# EAGLE design Power Switching Circuit rev2 (EAGLE 9.6.2)
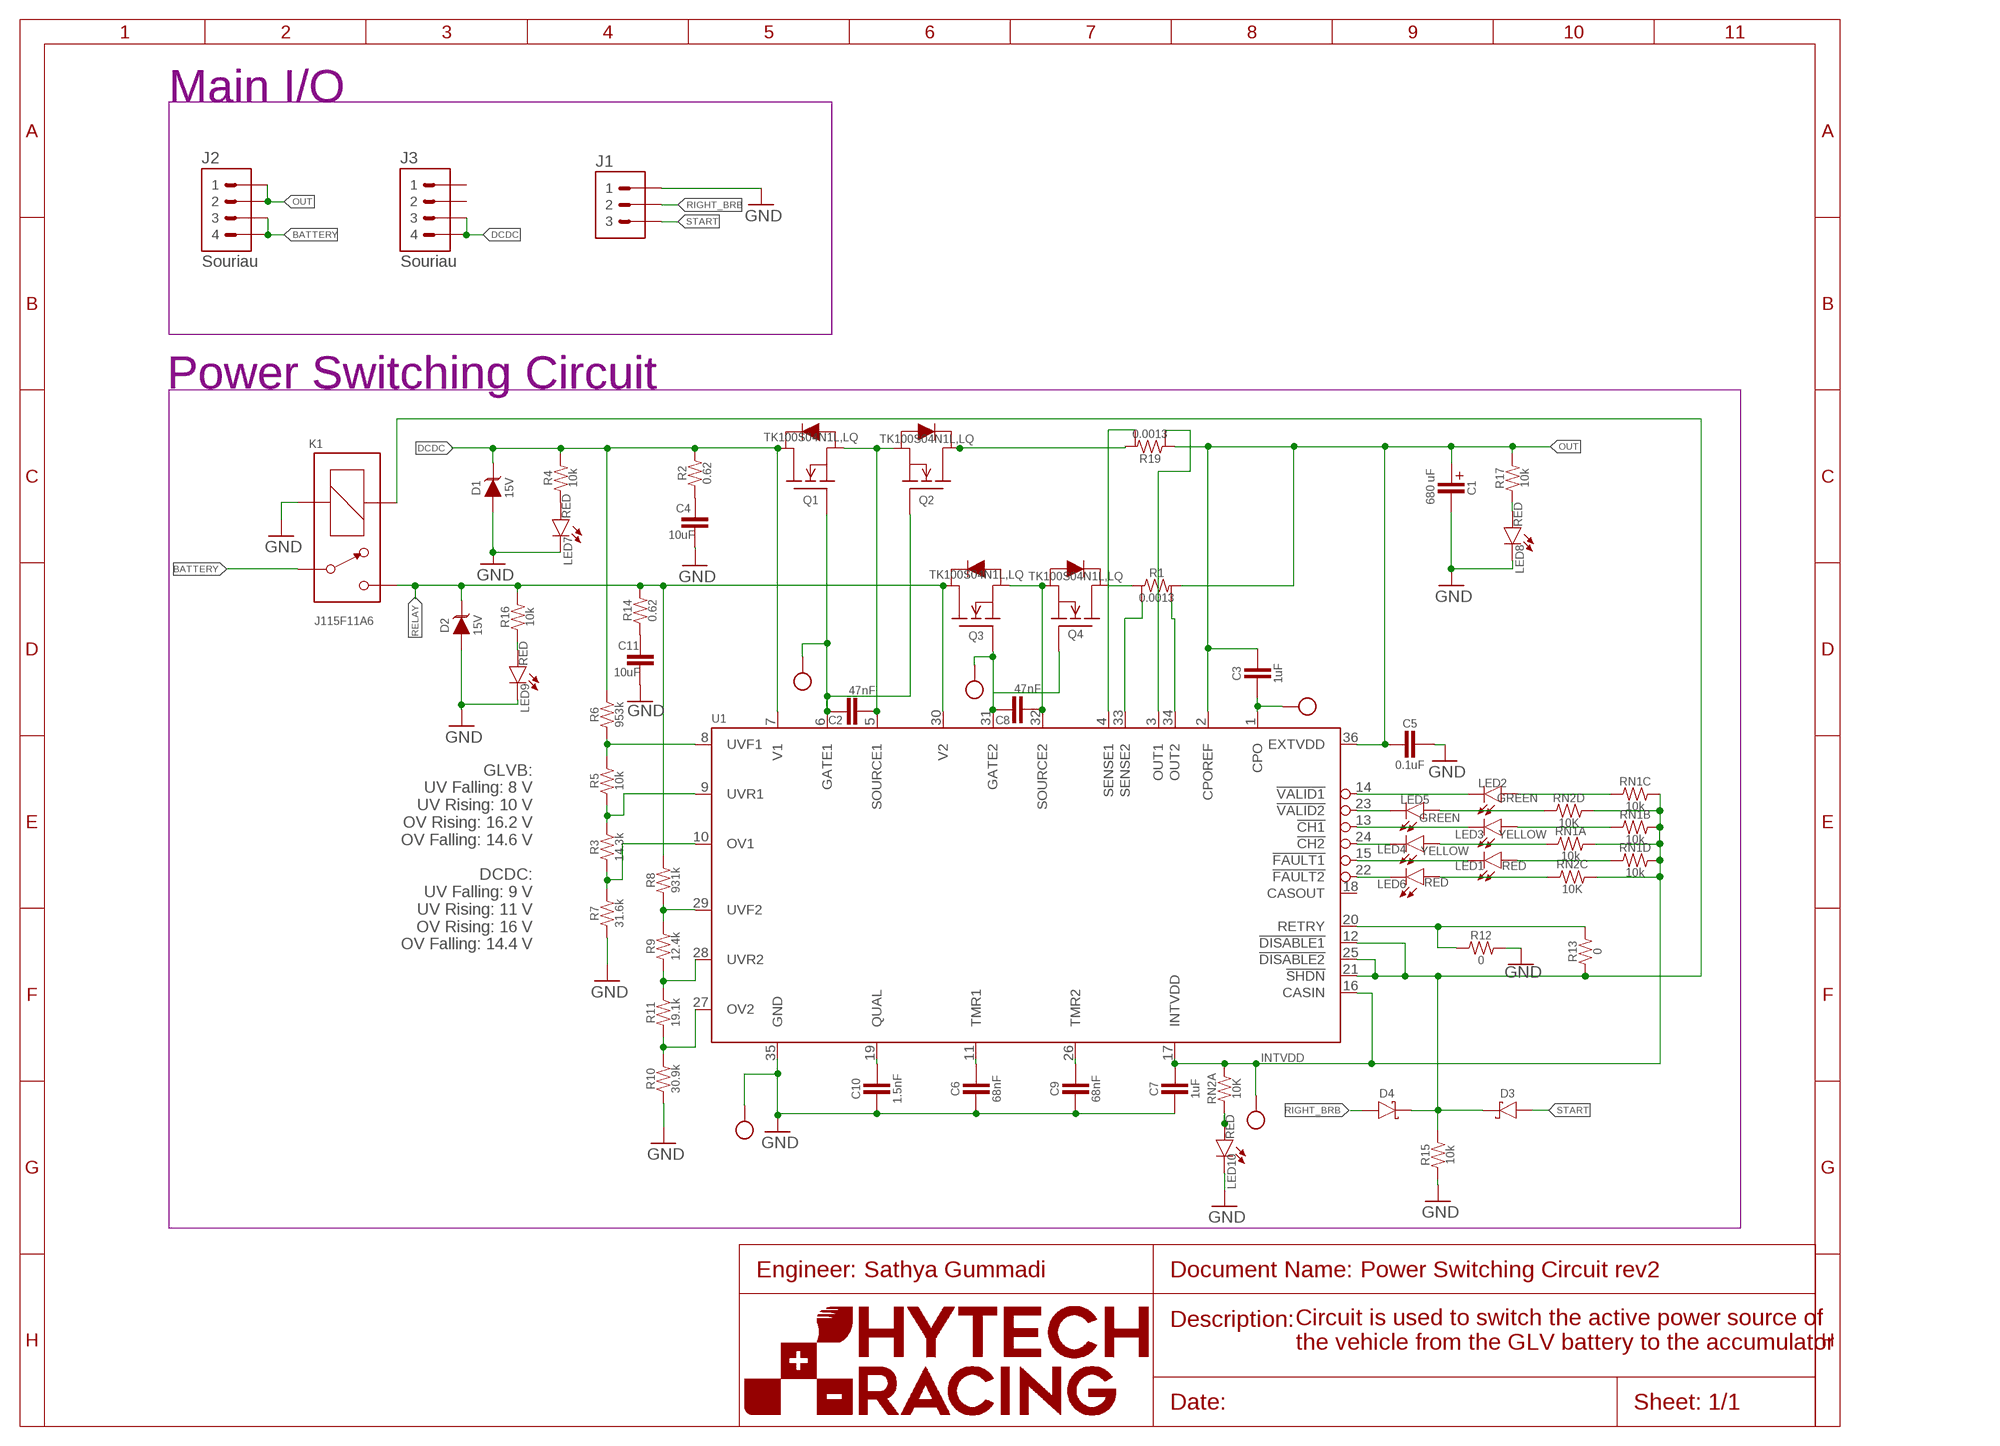
[diagram p0: schematic, sheet 1]
U$2 (FRAME_A): FRAME_DESCRIPTION: Default; ORIENTATION: LANDSCAPE; SIZE: A

## Parts
C1  CAPACITOR_POLARIZED  [EEE-FK1H681AM]
C2  47nF  CAP0603-CAP  [0603-CAP@1]
C3  1uF  CAP0805  [0805]
C4  10uF  CAPACITOR_VALUE1206  [1206-CAP]
C5  0.1uF  CAP0603-CAP  [0603-CAP@1]
C6  68nF  CAP0603-CAP  [0603-CAP@1]
C7  1uF  CAP0805  [0805]
C8  47nF  CAP0603-CAP  [0603-CAP@1]
C9  68nF  CAP0603-CAP  [0603-CAP@1]
C10  1.5nF  CAP0603-CAP  [0603-CAP@1]
C11  10uF  CAPACITOR_VALUE1206  [1206-CAP]
D1  TVS_15V  [SOT-23]
D2  TVS_15V  [SOT-23]
D3  SCHOTTKY  [CLP1608-2L]
D4  SCHOTTKY  [CLP1608-2L]
J1  CONNECTOR-3_  [SOURIAU_04-35]
J2  CONNECTOR-4_SOURIAU_  [SOURIAU_12-04]
J3  CONNECTOR-4_SOURIAU_  [SOURIAU_12-04]
K1  J115F11A6  [J115F11A*6*]
LED1  RED  LED-0603  [LED-603]
LED2  GREEN  LED-0603  [LED-603]
LED3  YELLOW  LED-0603  [LED-603]
LED4  YELLOW  LED-0603  [LED-603]
LED5  GREEN  LED-0603  [LED-603]
LED6  RED  LED-0603  [LED-603]
LED7  RED  LED-0603  [LED-603]
LED8  RED  LED-0603  [LED-603]
LED9  RED  LED-0603  [LED-603]
LED10  RED  LED-0603  [LED-603]
Q1  TRANSISTOR_N_MOS_2-7K1S_TK100S04N1L,LQ  [DPAK(2-7K1S)]
Q2  TRANSISTOR_N_MOS_2-7K1S_TK100S04N1L,LQ  [DPAK(2-7K1S)]
Q3  TRANSISTOR_N_MOS_2-7K1S_TK100S04N1L,LQ  [DPAK(2-7K1S)]
Q4  TRANSISTOR_N_MOS_2-7K1S_TK100S04N1L,LQ  [DPAK(2-7K1S)]
R1  RESISTOR_SENSE  [WSL2726]
R2  0.62  RESISTOR0805  [0805]
R3  14.3k  RESISTOR0603  [0603-RES]
R4  10k  RESISTOR0603  [0603-RES]
R5  10k  RESISTOR0603  [0603-RES]
R6  953k  RESISTOR0603  [0603-RES]
R7  31.6k  RESISTOR0603  [0603-RES]
R8  931k  RESISTOR0603  [0603-RES]
R9  12.4k  RESISTOR0603  [0603-RES]
R10  30.9k  RESISTOR0603  [0603-RES]
R11  19.1k  RESISTOR0603  [0603-RES]
R12  0  RESISTOR0603  [0603-RES]
R13  0  RESISTOR0603  [0603-RES]
R14  0.62  RESISTOR0805  [0805]
R15  10k  RESISTOR0603  [0603-RES]
R16  10k  RESISTOR0603  [0603-RES]
R17  10k  RESISTOR0603  [0603-RES]
R19  RESISTOR_SENSE  [WSL2726]
RN1  RESISTOR_NETWORK_4_10K  [YC/TC164]
RN2  RESISTOR_NETWORK_4_10K  [1206-RES]
U1  LTC4421  [SSOP-36]
U$7  TEST_POINTMICRO_MINIATURE  [MICRO_MINIATURE]
U$8  TEST_POINTMICRO_MINIATURE  [MICRO_MINIATURE]
U$9  TEST_POINTMICRO_MINIATURE  [MICRO_MINIATURE]
U$10  TEST_POINTMICRO_MINIATURE  [MICRO_MINIATURE]
U$11  TEST_POINTMICRO_MINIATURE  [MICRO_MINIATURE]

## Nets
!CH1: LED3.C U1.13(!CH1)
!CH2: LED4.C U1.24(!CH2)
!FAULT1: LED1.C U1.15(!FAULT1)
!FAULT2: LED6.C U1.22(!FAULT2)
!SHDN!: D3.2(C) D4.2(C) K1.COIL1(COIL+) R13.1 R15.2 U1.12(!DISABLE1) U1.21(!SHDN) U1.25(!DISABLE2)
!VALID1: LED2.C U1.14(!VALID1)
!VALID2: LED5.C U1.23(!VALID2)
BATTERY: J2.3 J2.4 K1.CONTACT1(P)
CPO: C3.2 U1.1(CPO) U$9.P$1
DCDC: D1.3(C) J3.3 J3.4 Q1.2(D) R2.2 R4.2 R6.2 U1.7(V1)
GATE1: C2.2 Q1.1(G) Q2.1(G) U1.6(GATE1) U$10.P$1
GATE2: C8.2 Q3.1(G) Q4.1(G) U1.31(GATE2) U$7.P$1
GND: C1.P$2(MINUS) C4.2 C5.1 C6.2 C7.2 C9.2 C10.2 C11.2 D1.1(A) D2.1(A) J1.A K1.COIL2(COIL-) LED7.C LED8.C LED9.C LED10.C R7.1 R10.1 R12.2 R15.1 U1.35(GND) U$11.P$1
INTVDD: C7.1 RN1.5 RN1.6 RN1.7 RN1.8 RN2.5 RN2.6 RN2.8 U1.16(CASIN) U1.17(INTVDD) U$8.P$1
N$1: C10.1 U1.19(QUAL)
N$2: C6.1 U1.11(TMR1)
N$3: C9.1 U1.26(TMR2)
N$4: C11.1 R14.1
N$5: Q4.2(D) R1.1
N$6: LED9.A R16.1
N$7: LED7.A R4.1
N$8: Q2.2(D) R19.2
N$9: LED10.A RN2.1
N$10: LED8.A R17.1
N$11: LED6.A RN2.3
N$13: LED1.A RN1.4
N$15: LED4.A RN1.1
N$17: LED3.A RN1.2
N$19: LED5.A RN2.4
N$21: LED2.A RN1.3
N$22: C4.1 R2.1
OUT: C1.P$1(PLUS) C3.1 C5.2 J2.1 J2.2 R1.2 R17.2 R19.1 U1.2(CPOREF) U1.36(EXTVDD)
OUT1: R19.3 U1.3(OUT1)
OUT2: R1.4 U1.34(OUT2)
OV1: R3.1 R7.2 U1.10(OV1)
OV2: R10.2 R11.1 U1.27(OV2)
RELAY: D2.3(C) K1.CONTACT2(S) Q3.2(D) R8.2 R14.2 R16.2 U1.30(V2)
RETRY: R12.1 R13.2 U1.20(RETRY)
RIGHT_BRB: D4.1(A) J1.B
SENSE: R19.4 U1.4(SENSE1)
SENSE2: R1.3 U1.33(SENSE2)
SOURCE1: C2.1 Q1.3(S) Q2.3(S) U1.5(SOURCE1)
SOURCE2: C8.1 Q3.3(S) Q4.3(S) U1.32(SOURCE2)
START: D3.1(A) J1.C
UVF1: R5.2 R6.1 U1.8(UVF1)
UVF2: R8.1 R9.2 U1.29(UVF2)
UVR1: R3.2 R5.1 U1.9(UVR1)
UVR2: R9.1 R11.2 U1.28(UVR2)
Unconnected: J3.1 J3.2 RN2.2 RN2.7 U1.18(CASOUT)

## Notes on the sheet
- Main I/O
- Power Switching Circuit
- 680 uF
- GLVB:
  UV Falling: 8 V
  UV Rising: 10 V
  OV Rising: 16.2 V
  OV Falling: 14.6 V
  
  DCDC:
  UV Falling: 9 V
  UV Rising: 11 V
  OV Rising: 16 V
  OV Falling: 14.4 V
- Sathya Gummadi
- Circuit is used to switch the active power source of 
  the vehicle from the GLV battery to the accumulator

## Library data of the parts
C1 = HyTechDevices:CAPACITOR_POLARIZED; RESISTANCE: 680 uF
C2 C3 C5-C10 = HyTechDevices:CAP: Capacitor Standard 0603 ceramic capacitor, and 0.1" leaded capacitor.
C4 C11 = HyTechDevices:CAPACITOR_VALUE: Capacitor for prototyping circuits
D1 D2 = HyTechDevices:TVS_*: TVS Diode GSOT Datasheet <https://www.mouser.com/datasheet/2/427/gsot03-1767593.pdf>; DKPN: GSOT15-E3-08CT-ND; MANUFACTURER: Vishay General Semiconductor - Diodes Division; MOPN: 78-GSOT15-E3-08; MPN: GSOT15-E3-08; VOLTAGE: 15V
D3 D4 = HyTechDevices:SCHOTTKY: Schottky Rectifier Diode Datasheet <https://www.vishay.com/docs/85892/vsky20401608.pdf>; DKPN: 112-VSKY20401608-G4-08CT-ND; MANUFACTURER: Vishay General Semiconductor - Diodes Division; MOPN: 78-VSKY20401608G408; MPN: VSKY20401608-G4-08
J1 = HyTechDevices:CONNECTOR-3_?
J2 J3 = HyTechDevices:CONNECTOR-4_?_*; MANUFACTURER: Souriau; MODEL: Souriau; MPN: 8STA21204PN
K1 = HyTechDevices:J115F11A*6*
LED1-LED10 = HyTechDevices:LED: Light Emitting Diode (LED) Source: Dangerous Prototypes Eagle Library <https://github.com/DangerousPrototypes/Eagle_Part_Library>
Q1-Q4 = HyTechDevices:TRANSISTOR_N_MOS_?_*: N-MOSFET PMV15ENEA Datasheet <https://www.mouser.com/datasheet/2/916/PMV15ENEA-1604828.pdf> TK6P65W Datasheet <https://www.mouser.com/datasheet/2/408/TK6P65W_datasheet_en_20151225-1916290.pdf> SIR638ADP Datasheet <https://www.mouser.com/datasheet/2/427/sir638adp-1766131.pdf> TK100S04N1L Datasheet <https://www.mouser.com/datasheet/2/408/TK100S04N1L_datasheet_en_20200624-1840137.pdf>; DKPN: TK100S04N1LLQ; MANUFACTURER: Toshiba Semiconductor and Storage; MOPN: 757-TK100S04N1LLQ; MPN: TK100S04N1L,LQ
R1 R19 = HyTechDevices:RESISTOR_SENSE: Sense Resistor; MPN: WSL2726; RESISTANCE: 0.0013
R2-R17 = HyTechDevices:RESISTOR: Resistor Basic schematic elements and footprints for 0603, 1206, and PTH resistors.
RN1 = HyTechDevices - Copy:RESISTOR_NETWORK_4_*: Resistor Network w/ 4 Indepedent Resistors Yageo TC Series <https://www.yageo.com/upload/media/product/productsearch/datasheet/rchip/PYu-YC_TC_group_51_RoHS_L_9.pdf>; RESISTANCE: 10k
RN2 = HyTechDevices:RESISTOR_NETWORK_4_*: Resistor Network, 4 Elements YC/TC Series <https://www.mouser.com/datasheet/2/447/yageo_yago_s_a0009164376_1-1991537.pdf> CAT/CAY 16 Series <https://www.mouser.com/datasheet/2/54/CATCAY-777361.pdf>; DKPN: YAG3410CT-ND; MANUFACTURER: Yageo; MOPN: 603-TC164-FR-0710KL; MPN: TC164-FR-0710KL; POWER: 1/16W; RESISTANCE: 10K; TOLERANCE: 1%; VOLTAGE: 50V
U1 = HyTechDevices:LTC4421
U$7-U$11 = HyTechDevices:TEST_POINT: Keystone Electronics Test Point 5005

## Board
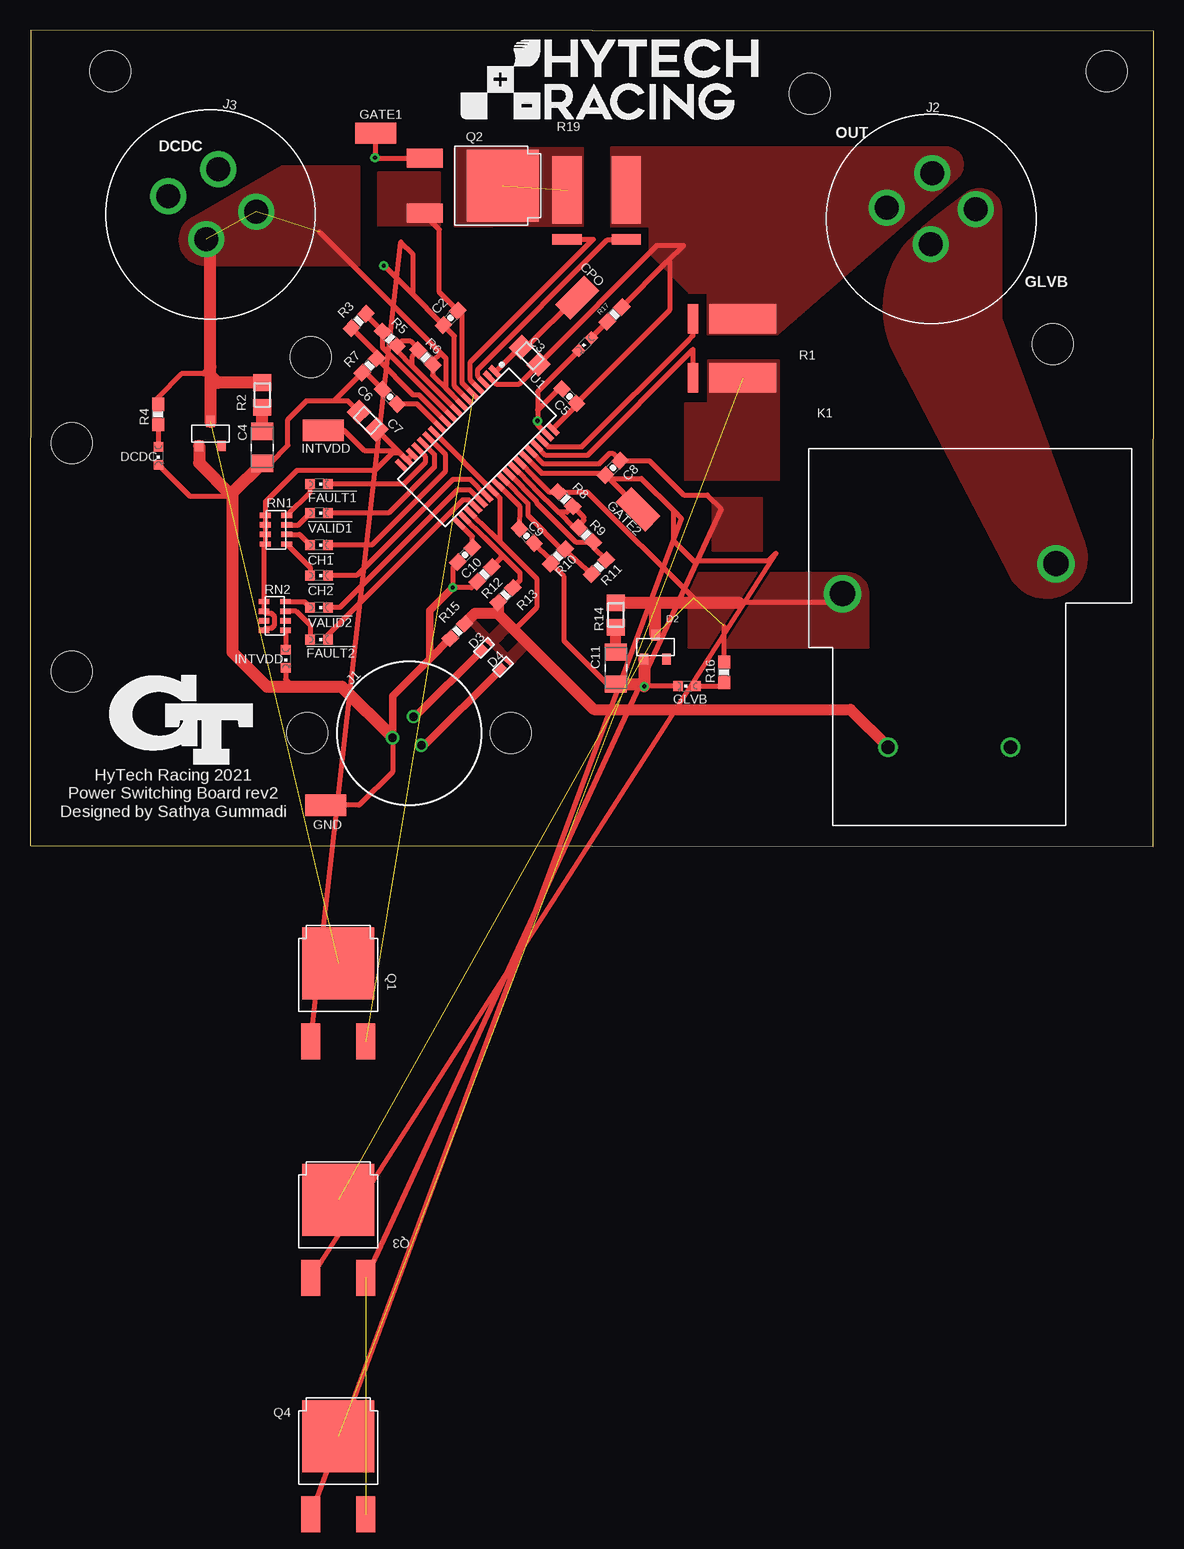
[diagram p1: board, top side]
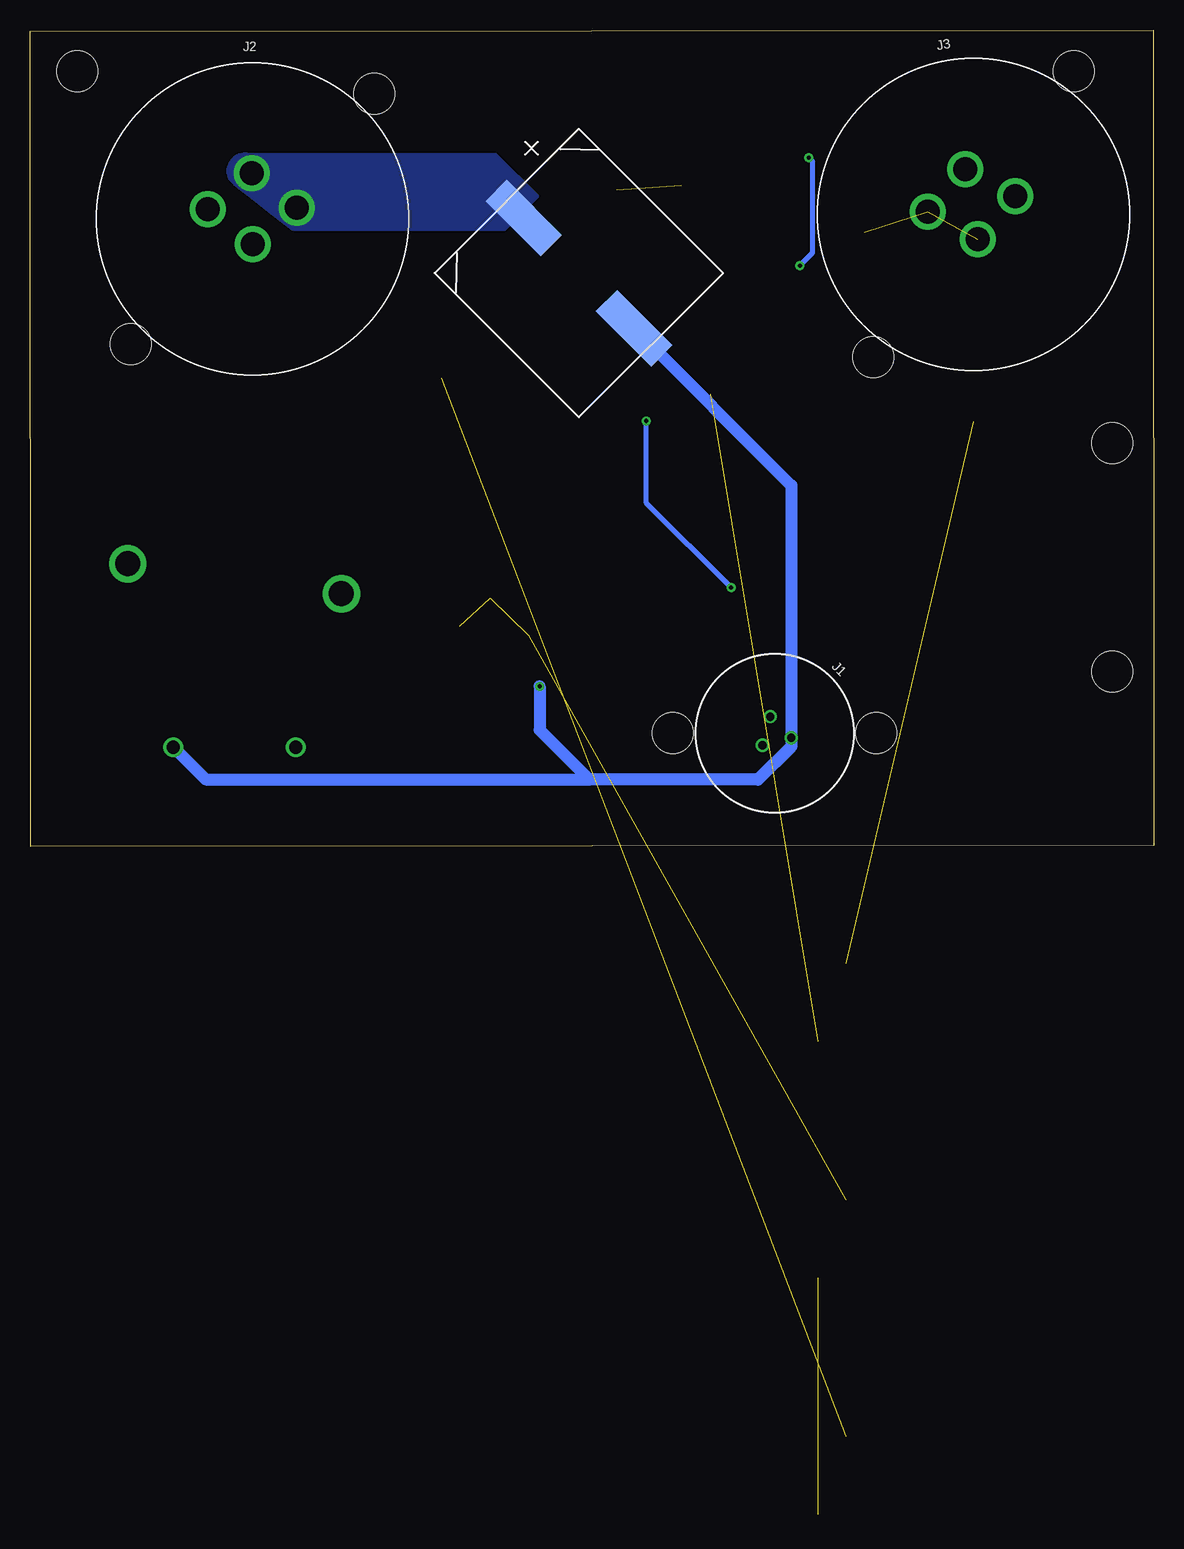
[diagram p2: board, bottom side, seen from below]

Size 93.65 x 68.07 mm. Coordinates in mm from the lower left corner, seen from the top.
Outline: 0,0.1 93.6,0 93.65,67.97 0.05,68.07 0,0.1
Copper layers (1*16): Top 0.035mm / dielectric 1.53mm / Bottom 0.035mm
Design rules "JLCPCB (2 Layer) - 2oz": minimum track width 8mil, minimum drill 0.3mm, track to track 8mil, track to pad 8mil, pad to pad 8mil, via to via 20mil, smd to smd 8mil, copper to edge 0.2mm, drill to drill 21mil, minimum pad ring 8mil, minimum via ring 8mil, stop-mask expansion 6mil, vias tented up to drill 30mil, thermal gap 10mil

### Footprints (pad centres in the part's own frame; a part is rotated, then mirrored left to right if it is on the bottom)
EEE-FK1H681AM = smd 2.5 x 6.5: P$1 0,6.5; P$2 0,-6.5
0603-CAP@1 = smd 1.1 x 1: 1 -0.85,0; 2 0.85,0
0805 = smd 1.4 x 1.5: 1 -1.025,0; 2 1.025,0
1206-CAP = smd 1.44 x 1.82: 1 -1.336,0; 2 1.336,0
SOT-23 = smd 0.711 x 0.889: 1 -0.94,-1.003; 2 0.94,-1.003; 3 0,1.003
CLP1608-2L = smd 0.88 x 0.62: 1 -0.295,0 | smd 0.28 x 0.62: 2 0.595,0
SOURIAU_04-35 = drill 0.7: A 1.24,0.72; B 0,-1.43; C -1.24,0.72 | hole 3.4: 6,6; -6,-6
SOURIAU_12-04 = drill 2: 1 0,3.81; 2 3.708,0.889; 3 0,-2.108; 4 -3.708,0.889 | hole 3.4: 10.288,10.288; -10.288,-10.288
J115F11A*6* = drill 1.1: COIL1 -5.1,0; COIL2 5.1,0 | drill 2.1: CONTACT1 8.9,15.3; CONTACT2 -8.9,12.8
LED-603 = smd 0.8 x 0.8: A 0,-0.75; C 0,0.75
DPAK(2-7K1S) = smd 1.6 x 3: 1 -2.3,-3.5; 3 2.3,-3.5 | smd 6 x 6: 2 0,3
WSL2726 = smd 2.438 x 5.588: 1 -2.464,-1.524; 2 2.464,-1.524 | smd 2.438 x 0.889: 3 -2.464,2.603; 4 2.464,2.603
0603-RES = smd 1.1 x 1: 1 -0.85,0; 2 0.85,0
YC/TC164 = smd 0.45 x 0.9: 1 -1.2,-0.9; 2 -0.4,-0.9; 3 0.4,-0.9; 4 1.2,-0.9; 5 1.2,0.9; 6 0.4,0.9; 7 -0.4,0.9; 8 -1.2,0.9
1206-RES = smd 0.45 x 0.9: 1 -1.2,-0.9; 2 -0.4,-0.9; 3 0.4,-0.9; 4 1.2,-0.9; 5 1.2,0.9; 6 0.4,0.9; 7 -0.4,0.9; 8 -1.2,0.9
SSOP-36 = smd 0.42 x 1.25: 1 -5.525,-3.375; 2 -4.875,-3.375; 3 -4.225,-3.375; 4 -3.575,-3.375; 5 -2.925,-3.375; 6 -2.275,-3.375; 7 -1.625,-3.375; 8 -0.975,-3.375; 9 -0.325,-3.375; 10 0.325,-3.375; 11 0.975,-3.375; 12 1.625,-3.375; 13 2.275,-3.375; 14 2.925,-3.375; 15 3.575,-3.375; 16 4.225,-3.375; 17 4.875,-3.375; 18 5.525,-3.375; 19 5.525,3.375; 20 4.875,3.375; 21 4.225,3.375; 22 3.575,3.375; 23 2.925,3.375; 24 2.275,3.375; 25 1.625,3.375; 26 0.975,3.375; 27 0.325,3.375; 28 -0.325,3.375; 29 -0.975,3.375; 30 -1.625,3.375; 31 -2.275,3.375; 32 -2.925,3.375; 33 -3.575,3.375; 34 -4.225,3.375; 35 -4.875,3.375; 36 -5.525,3.375
MOUNTING_M3 = hole 3.4: 0,0
MICRO_MINIATURE = smd 3.429 x 1.778: P$1 0,0

### Placement (x,y rotation side)
C1  47.9,47.8 45 bottom
C2  35.05,44.07 225 top
C3  41.66,40.91 135 top
C4  19.35,33.27 270 top
C5  44.94,37.55 315 top
C6  29.99,37.49 135 top
C7  28.13,35.51 135 top
C8  48.56,31.57 225 top
C9  41.39,25.91 315 top
C10  36.26,24.32 225 top
C11  48.82,14.88 270 top
D1  15.04,34.42 0 top
D2  52.12,16.64 0 top
D3  37.85,16.56 45 top
D4  39.42,14.99 45 top
J1  31.6,9.45 315 bottom
J2  75.11,52.32 0.9 bottom
J3  15.04,52.7 10 bottom
K1  J115F11A6*  [J115F11A*6*]  76.61,8.28 0 top
LED1  24.09,30.22 270 top
LED2  24.09,27.8 270 top
LED3  24.09,25.14 270 top
LED4  24.09,22.6 270 top
LED5  24.09,19.93 270 top
LED6  24.09,17.26 270 top
LED7  10.69,32.59 180 top
LED8  46.25,41.88 135 top
LED9  54.76,13.39 90 top
LED10  21.31,15.67 180 top
Q1  25.69,-12.75 0 top  (outside the outline)
Q2  36.4,55.09 270 top
Q3  25.69,-32.45 0 top  (outside the outline)
Q4  25.69,-52.15 0 top  (outside the outline)
R1  57.86,41.53 90 top
R2  19.35,37.64 90 top
R3  27.4,43.83 45 top
R4  10.67,36.02 90 top
R5  29.99,42.34 315 top
R6  32.96,40.77 315 top
R7  28.28,40.1 45 top
R8  44.63,28.97 135 top
R9  46.33,26 135 top
R10  44,24.2 45 top
R11  47.41,23.31 45 top
R12  37.87,22.69 225 top
R13  39.63,20.97 45 top
R14  48.82,19.3 90 top
R15  35.61,17.97 45 top
R16  57.84,14.53 90 top
R17  48.72,44.37 45 top
R19  47.22,53.21 180 top
RN1  20.5,26.42 90 top
RN2  20.4,19.23 90 top
U1  37.26,33.27 225 top
U$1  [MOUNTING_M3]  3.48,14.6 0 top
U$3  [MOUNTING_M3]  3.48,33.66 0 top
U$4  [MOUNTING_M3]  89.71,64.64 0 top
U$5  [LOGO_GT_0.50"]  12.57,10.57 0 top
U$6  [LOGO_HYTECH_1.0"]  35.61,60.33 0 top
U$7  50.67,28.12 135 top
U$8  24.43,34.7 0 top
U$9  45.59,45.77 45 top
U$10  28.8,59.46 0 top
U$11  24.64,3.45 0 top

### Tracks (layer width: path | path; a pad name or v marks a point on that pad's centre or on a via)
!CH1
  Top 0.406: U1.13 34.59,32.72 34.59,31.24 28.49,25.14 LED3.C
!CH2
  Top 0.406: U1.24 36.71,30.61 35.23,30.61 27.22,22.6 LED4.C
!FAULT1
  Top 0.406: LED1.C 31.16,30.22 32.94,31.99 32.94,32.54 U1.15
!FAULT2
  Top 0.406: U1.22 36.58,28.9 36.06,28.9 24.84,17.68 LED6.C
!SHDN!
  Top 0.406: U1.12 U1.25 39.16,29.08 39.16,25.41 | 40.34,18.06 42.21,19.94 42.21,22.35 39.16,25.41 | 38.34,26.23 38.33,26.23 | 38.34,26.23 39.16,25.41 | 38.34,26.23 38.33,26.23 | U1.21 38.33,26.23 | R15.2 36.53,18.57 36.5,18.85
  Top 0.914: R13.1 39.03,19.68 | 39.03,19.68 39.03,19.37 40.34,18.06 46.97,11.43 68.36,11.43 K1.COIL1 | 39.03,19.68 38.77,19.43 37.08,19.43 36.5,18.85
  pour Top (no thermals): 40.08,15.06 36.14,19.05 36.51,19.42 40.43,15.41
  pour Top (no thermals): 38.29,17.61 39.33,18.66 39.98,18.01 38.94,16.94
  pour Top (no thermals): 40.41,15.44 41.78,16.84 41.2,17.48 39.79,16.07
!VALID1
  Top 0.406: U1.14 33.71,32.69 33.71,31.62 29.89,27.8 LED2.C
!VALID2
  Top 0.406: U1.23 36.68,29.72 35.61,29.72 25.82,19.93 LED5.C
BATTERY
  pour Top (no thermals): 77.98,54.39 arc-133 80.95,52.82 80.95,43.95 87.86,25.26 arc-177 81.63,22.77 72.11,41.06 arc-80 74.41,51.58 arc-4
CPO
  Top 0.406: U1.1 40.89,41.67 C3.2 41.37,41.63 45.5,45.77 U$9.P$1
DCDC  (3 unrouted)
  Top 0.406: U1.7 35.22,37.62 | 35.22,37.62 34.68,38.15 34.68,40.68 34.21,41.15 | 35.22,37.62 34.84,38 33.56,39.27 R6.2 33.56,40.49 34.21,41.15 | 24.13,51.23 34.21,41.15 | 15.04,40 14.45,39.42 12.62,39.42 10.67,37.47 R4.2
  Top 1.016: R2.2 15.66,38.67 15.04,39.29 | 15.04,39.29 D1.3 | J3.3 15.04,50.26 15.04,40 15.04,39.29
  pour Top (no thermals): 13.72,52.49 20.96,56.67 27.46,56.67 27.46,48.49 14.58,48.49 arc-156
GATE1  (via drill 0.35)
  Top 0.406: U1.6 35.36,38.4 35.36,42.56 C2.2 34.22,43.47 34.22,43.7 31.88,46.04 | U$10.P$1 28.8,57.48 v28.75,57.43 28.78,57.4 Q2.1 | 31.88,46.04 31.88,49.43 30.91,50.4 Q1.1 | 31.88,46.04 29.59,48.33 29.59,48.36 29.51,48.44 v29.49,48.44
  Bottom 0.406: v28.75,57.43 28.42,57.1 28.42,49.5 v29.49,48.44
GATE2
  Top 0.406: C8.2 47.81,31.12 42.63,31.12 U1.31 | C8.2 | C8.2 50.67,28.26 U$7.P$1 | C8.2 48.25,30.68 50.94,30.68 53.62,28 | Q3.1 62.16,24.44 61.52,23.8 55.3,23.8 53.62,25.47 53.62,28 | 53.62,28 54.28,27.34 Q4.1
GND  (via drill 0.35)
  Top 0.406: C9.2 43.4,23.91 R10.1 44.5,22.5 44.5,17.14 48.1,13.55 C11.2 | C6.2 27.98,39.5 R7.1 25.32,37.13 | v42.29,35.48 42.29,36.4 44.04,38.15 C5.1 | R12.2 36.77,21.59 v35.23,21.59 35.23,23.29 C10.2 | v42.29,35.48 42.29,35.14 U1.35 | LED7.C 13.31,29.22 16.87,29.22 | LED9.C 51.21,13.39 v51.18,13.36 | LED8.C 42.29,37.92 v42.29,35.48 | 25.32,37.13 23.01,37.13 21.49,35.61 21.49,33.46 19.96,31.94 C4.2 | C7.2 26.51,37.13 25.32,37.13 | LED10.C 21.31,13.94 21.95,13.31 | J1.A 30.21,6.23 27.43,3.45 U$11.P$1
  Top 0.61: R15.1 33.3,15.65 | 33.3,15.65 30.21,12.56 J1.A | v35.23,21.59 33.3,19.66 33.3,15.65
  Top 1.016: D2.1 v51.18,13.36 51.02,13.52 48.84,13.52 C11.2 | 16.87,29.22 14.1,31.99 D1.1 | 16.87,29.22 16.87,16.2 19.76,13.31 21.95,13.31 25.98,13.31 J1.A | C4.2 16.87,29.45 16.87,29.22
  Bottom 0.406: v42.29,35.48 42.29,28.65 v35.23,21.59 | C1.P$2
  Bottom 1.016: v51.18,13.36 51.18,9.73 47.05,5.6 | 47.05,5.6 47.03,5.57 32.98,5.57 30.21,8.34 J1.A 30.21,30.11 C1.P$2 | 47.05,5.6 79.02,5.6 K1.COIL2
INTVDD
  Top 0.406: U1.17 U1.16 | U1.17 31.4,32.21 30.79,32.83 30.53,32.83 | 30.53,32.83 30.21,32.83 28.75,31.37 22.25,31.37 19.61,28.73 19.61,27.63 RN1.5 RN1.6 RN1.7 RN1.8 19.47,25.09 19.47,20.4 RN2.5 RN2.6 19.66,19.46 20.11,19.46 20.35,19.22 20.35,18.43 20.11,18.2 19.66,18.2 RN2.8 | U1.17 C7.1 | 30.53,32.83 30.39,32.97 27.91,32.97 26.19,34.7 U$8.P$1
N$1
  Top 0.406: C10.1 36.86,25.86 U1.19
N$2
  Top 0.406: U1.11 32.26,36.89 C6.1
N$3
  Top 0.406: U1.26 40.79,28.36 C9.1
N$4
  Top 0.914: C11.1 R14.1
N$5  (1 unrouted)
  pour Top (no thermals): 54.58,30.58 62.41,30.58 62.41,40.51 56.52,40.51 56.52,36.93 54.58,36.93
N$6
  Top 0.406: R16.1 57.52,13.36 55.54,13.36 LED9.A
N$7
  Top 0.406: R4.1 10.69,35.14 LED7.A
N$8  (1 unrouted)
  pour Top (no thermals): 46.08,51.74 46.08,58.22 35.41,58.22 35.41,51.71 38.51,51.71 38.51,51.74
N$9
  Top 0.406: RN2.1 21.31,18.01 LED10.A
N$10
  Top 0.406: R17.1 48.12,43.75 LED8.A
N$11
  Top 0.406: LED6.A 23.34,18.46 22.18,19.63 RN2.3
N$13
  Top 0.406: RN1.4 23.34,29.56 LED1.A
N$15
  Top 0.406: RN1.1 23.34,23.27 LED4.A
N$17
  Top 0.406: RN1.2 22.46,26.02 LED3.A
N$19
  Top 0.406: RN2.4 21.31,20.41 22.86,20.41 LED5.A
N$21
  Top 0.406: RN1.3 22.36,26.82 LED2.A
N$22
  Top 1.016: C4.1 R2.1
OUT
  Top 0.406: U1.2 38.9,38.52 40.72,38.52 C3.1 42.38,40.23 52.27,50.13 54.47,50.13 53.12,48.78 | U1.36 45.54,36.78 C5.2 53.3,44.71 53.3,48.78 53.12,48.78 | R17.2 53.12,48.78
  Bottom 1.016: C1.P$1 54.06,53.96
  pour Bottom (no thermals): 75.39,57.73 54.84,57.73 51.31,54.2 54.08,51.44 71.7,51.44 arc1 76.58,55.22 arc153 75.44,57.73 arc-21 75.41,57.73 arc21
  pour Top (no thermals): 48.44,58.24 48.44,51.71 51.64,51.71 51.64,49.48 54.94,46.18 56.49,46.18 56.49,42.7 62.28,42.7 77.24,55.78 arc128 76.57,58.24
OUT1
  Top 0.406: U1.3 37.31,39.2 37.31,39.78 48.12,50.58 49.68,50.58 R19.3
OUT2
  Top 0.406: U1.34 43.17,33.34 45.99,33.34 54.93,42.28 55.23,42.59 55.26,42.61 R1.4
OV1
  Top 0.406: U1.10 32.4,37.67 31.91,37.67 R7.2 28.88,41.14 R3.1
OV2
  Top 0.406: R10.2 44.6,24.74 | 44.6,24.74 R11.1 | U1.27 41.48,28.59 41.48,27.62 44.36,24.74 44.6,24.74
RELAY  (3 unrouted)
  Top 0.406: U1.30 41.98,30.85 43.26,29.57 R8.2 46.43,29.57 55.3,20.7 | R16.2 57.84,18.36 | K1.CONTACT2 66.95,20.33 59.07,20.33
  Top 1.016: D2.3 52.12,20.33 | R14.2 52.12,20.33 | 52.12,20.33 59.07,20.33
  pour Top (no thermals): 54.91,22.81 68.09,22.81 arc-82 69.85,21.27 69.85,16.59 54.91,16.59
RETRY
  Top 0.406: U1.20 37.8,25.84 39.15,24.49 39.22,24.43 | R12.1 39.22,24.03 39.22,24.43 | R13.2 40.82,22.16 40.82,22.82 39.22,24.43
RIGHT_BRB
  Top 0.61: D4.1 32.87,8.44 J1.B
SENSE
  Top 0.406: U1.4 36.7,38.89 36.7,40.39 46.94,50.62 46.94,50.61 R19.4
SENSE2
  Top 0.406: U1.33 42.99,32.6 46.42,32.6 55.24,41.43 55.24,39.06 R1.3
SOURCE1  (1 unrouted)
  Top 0.406: U1.5 36.02,38.66 36.02,44.31 C2.1 34.11,46.21 34.11,51.44 32.73,52.81 Q2.3
  pour Top (no thermals): 34.16,51.82 34.16,56.16 29.01,56.16 29.01,51.82
SOURCE2  (1 unrouted)
  Top 0.406: U1.32 42.78,31.89 47.4,31.9 47.55,32.05 47.57,32.05 48.31,32.79 48.55,32.79 C8.1 51.62,32.17 54.48,29.31 56.44,29.31 57.59,28.16 Q3.3
  pour Top (no thermals): 56.9,24.66 60.99,24.66 60.99,29.03 56.9,29.03
START
  Top 0.61: D3.1 32.12,10.84 J1.C
UVF1
  Top 0.406: U1.8 34.39,37.52 31.85,40.06 | 31.85,40.06 30.59,41.33 R5.2 31.01,42.16 31.67,42.16 32.36,41.48 R6.1 31.85,40.87 31.85,40.06
UVF2
  Top 0.406: U1.29 41.99,29.92 44.05,27.87 | 44.05,27.87 45.31,26.6 R9.2 45.73,26.76 46.15,27.18 46.15,27.45 R8.1 44.73,27.87 44.05,27.87
UVR1
  Top 0.406: R3.2 28,44.34 R5.1 29.39,41.61 U1.9 | R3.2
UVR2
  Top 0.406: U1.28 42.2,28.79 42.2,28.69 45.49,25.4 R9.1 46.93,24.98 R11.2

### Text on the board
tPlace: GATE1 | OUT | DCDC | CPO | GLVB | DCDC | INTVDD | !FAULT1 | !VALID1 | GATE2 | !CH1 | !CH2 | !VALID2 | INTVDD | !FAULT2 | GLVB | HyTech Racing 2021 / Power Switching Board rev2 / Designed by Sathya Gummadi | GND